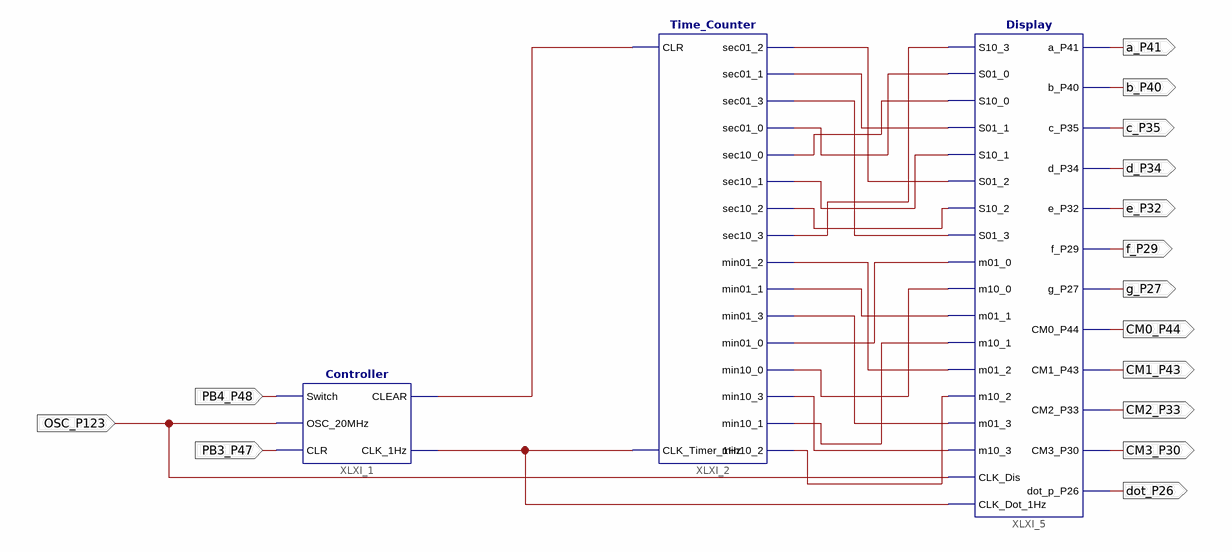
[diagram p0: schematic sheet 1]
// Xilinx ISE schematic lab7.sch (spartan6) as structural Verilog: 3 symbols, 15 ports
module lab7 (
  input  PB4_P48,
  input  OSC_P123,
  input  PB3_P47,
  output a_P41,
  output b_P40,
  output c_P35,
  output d_P34,
  output e_P32,
  output f_P29,
  output g_P27,
  output CM0_P44,
  output CM1_P43,
  output CM2_P33,
  output CM3_P30,
  output dot_P26
);

  wire XLXN_9, XLXN_22, XLXN_24, XLXN_25, XLXN_26, XLXN_27, XLXN_28, XLXN_29, XLXN_30, XLXN_31, XLXN_32,
       XLXN_33, XLXN_34, XLXN_35, XLXN_36, XLXN_37, XLXN_38, XLXN_39;

  Controller XLXI_1 (.Switch(PB4_P48), .OSC_20MHz(OSC_P123), .CLR(PB3_P47), .CLEAR(XLXN_9), .CLK_1Hz(XLXN_22));
  Time_Counter XLXI_2 (
    .CLR(XLXN_9), .CLK_Timer_1Hz(XLXN_22), .sec01_2(XLXN_24), .sec01_1(XLXN_25), .sec01_3(XLXN_26),
    .sec01_0(XLXN_27), .sec10_0(XLXN_28), .sec10_1(XLXN_29), .sec10_2(XLXN_30), .sec10_3(XLXN_31),
    .min01_2(XLXN_32), .min01_1(XLXN_33), .min01_3(XLXN_34), .min01_0(XLXN_35), .min10_0(XLXN_36),
    .min10_3(XLXN_37), .min10_1(XLXN_38), .min10_2(XLXN_39));
  Display XLXI_5 (
    .S10_3(XLXN_31), .S01_0(XLXN_27), .S10_0(XLXN_28), .S01_1(XLXN_25), .S10_1(XLXN_29), .S01_2(XLXN_24),
    .S10_2(XLXN_30), .S01_3(XLXN_26), .m01_0(XLXN_35), .m10_0(XLXN_36), .m01_1(XLXN_33), .m10_1(XLXN_38),
    .m01_2(XLXN_32), .m10_2(XLXN_39), .m01_3(XLXN_34), .m10_3(XLXN_37), .CLK_Dis(OSC_P123),
    .CLK_Dot_1Hz(XLXN_22), .a_P41(a_P41), .b_P40(b_P40), .c_P35(c_P35), .d_P34(d_P34), .e_P32(e_P32),
    .f_P29(f_P29), .g_P27(g_P27), .CM0_P44(CM0_P44), .CM1_P43(CM1_P43), .CM2_P33(CM2_P33), .CM3_P30(CM3_P30),
    .dot_p_P26(dot_P26));
endmodule
